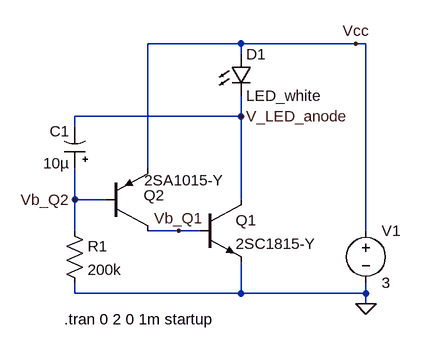
[diagram p0: schematic L.asc]
L.asc, the LTspice schematic file:
Version 4
SHEET 1 880 680
WIRE 160 -144 16 -144
WIRE 336 -144 160 -144
WIRE 352 -144 336 -144
WIRE 160 -128 160 -144
WIRE 160 -32 160 -64
WIRE 160 -32 -96 -32
WIRE -96 -16 -96 -32
WIRE 16 48 16 -144
WIRE -96 96 -96 48
WIRE -48 96 -96 96
WIRE 160 96 160 -32
WIRE -96 144 -96 96
WIRE 64 144 16 144
WIRE 96 144 64 144
WIRE 352 144 352 -144
WIRE -96 240 -96 224
WIRE 160 240 160 192
WIRE 160 240 -96 240
WIRE 352 240 352 224
WIRE 352 240 160 240
WIRE 352 256 352 240
FLAG 352 256 0
FLAG 64 144 Vb_Q1
FLAG 336 -144 Vcc
FLAG -96 96 Vb_Q2
FLAG 160 -32 V_LED_anode
SYMBOL npn 96 96 R0
SYMATTR InstName Q1
SYMATTR Value 2SC1815-Y
SYMBOL pnp -48 144 M180
WINDOW 0 58 55 Left 2
WINDOW 3 59 78 Left 2
SYMATTR InstName Q2
SYMATTR Value 2SA1015-Y
SYMBOL res -112 128 R0
SYMATTR InstName R1
SYMATTR Value 200k
SYMATTR SpiceLine tol=5 pwr=0.25
SYMBOL LED 144 -128 R0
SYMATTR InstName D1
SYMATTR Value LED_white
SYMBOL voltage 352 128 R0
WINDOW 123 0 0 Left 0
WINDOW 39 0 0 Left 0
SYMATTR InstName V1
SYMATTR Value 3
SYMBOL polcap -80 48 R180
WINDOW 0 24 57 Left 2
WINDOW 3 24 8 Left 2
SYMATTR InstName C1
SYMATTR Value 10µ
TEXT -112 280 Left 2 !.tran 0 2 0 1m startup

The netlist it stands for:
* L.asc
Q1 V_LED_anode Vb_Q1 0 0 2SC1815-Y
Q2 Vb_Q1 Vb_Q2 Vcc 0 2SA1015-Y
R1 Vb_Q2 0 200k tol=5 pwr=0.25
D1 Vcc V_LED_anode LED_white
V1 Vcc 0 3
C1 Vb_Q2 V_LED_anode 10µ
.model D D
.lib standard.dio
.model NPN NPN
.model PNP PNP
.lib standard.bjt
.tran 0 2 0 1m startup
.backanno
.end